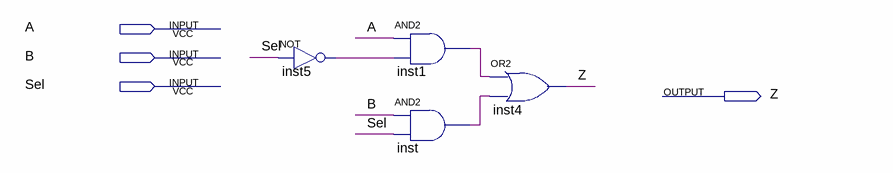
[diagram p0: schematic sheet]
// Quartus schematic mux.bdf as structural Verilog: 4 symbols, 4 pins
module mux (
  input  A,
  input  B,
  input  Sel,
  output Z
);

  wire inst1_out, inst5_out, inst_out;

  not inst5 (inst5_out, Sel);
  and inst1 (inst1_out, A, inst5_out);
  and inst (inst_out, B, Sel);
  or inst4 (Z, inst1_out, inst_out);
endmodule
